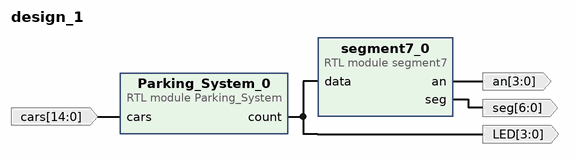
[diagram p0: block diagram of the top level]
# Vivado block design design_1, xc7a35tcpg236-1, Vivado 2021.1
create_bd_design design_1

create_bd_port -dir I -from 14 -to 0 cars
create_bd_port -dir O -from 6 -to 0 seg
create_bd_port -dir O -from 3 -to 0 LED
create_bd_port -dir O -from 3 -to 0 an

create_bd_cell -type module -reference Parking_System Parking_System_0
create_bd_cell -type module -reference segment7 segment7_0

# ---- connections ----

connect_bd_net [get_bd_pins Parking_System_0/count] [get_bd_ports LED] [get_bd_pins segment7_0/data]
connect_bd_net [get_bd_ports cars] [get_bd_pins Parking_System_0/cars]
connect_bd_net [get_bd_pins segment7_0/an] [get_bd_ports an]
connect_bd_net [get_bd_pins segment7_0/seg] [get_bd_ports seg]

validate_bd_design
save_bd_design
